# EAGLE board dat1 (EAGLE 6.1)
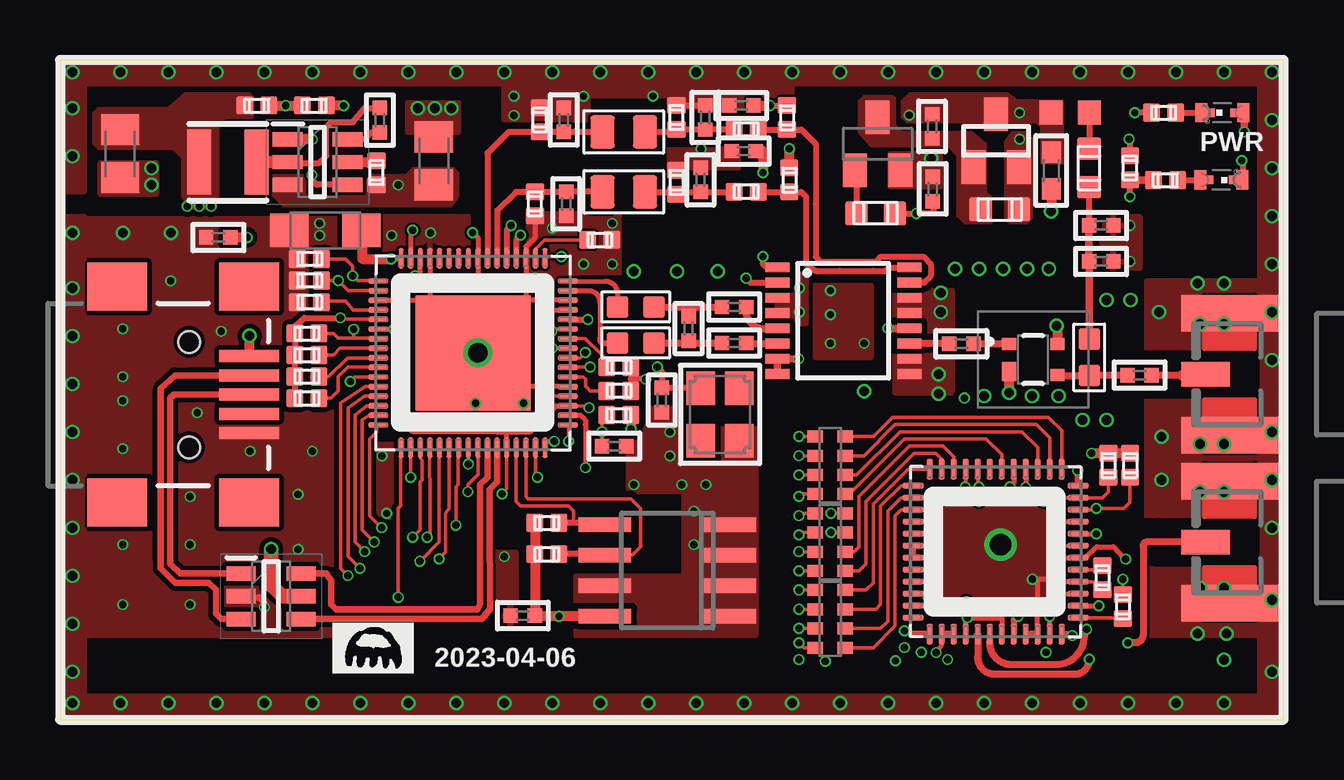
[diagram p2: board, top side]
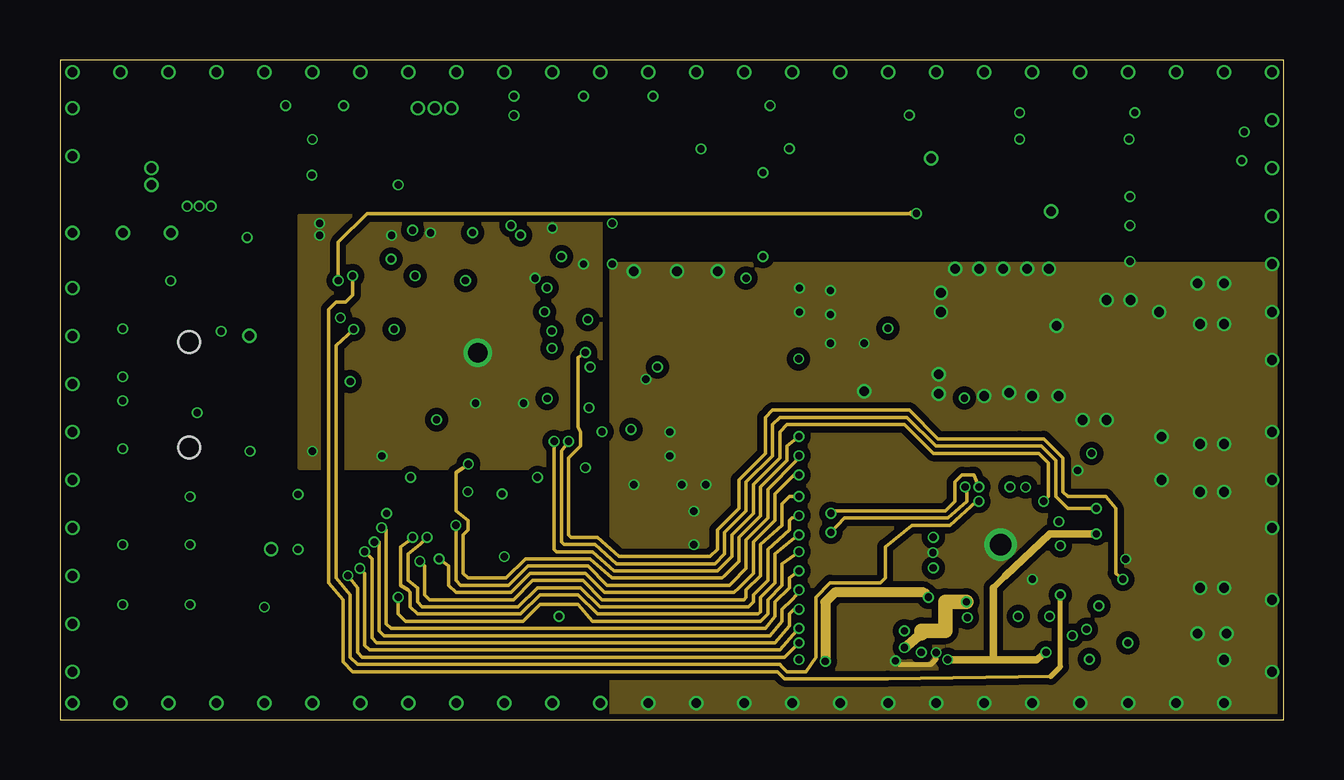
[diagram p3: board, inner layer Route2]
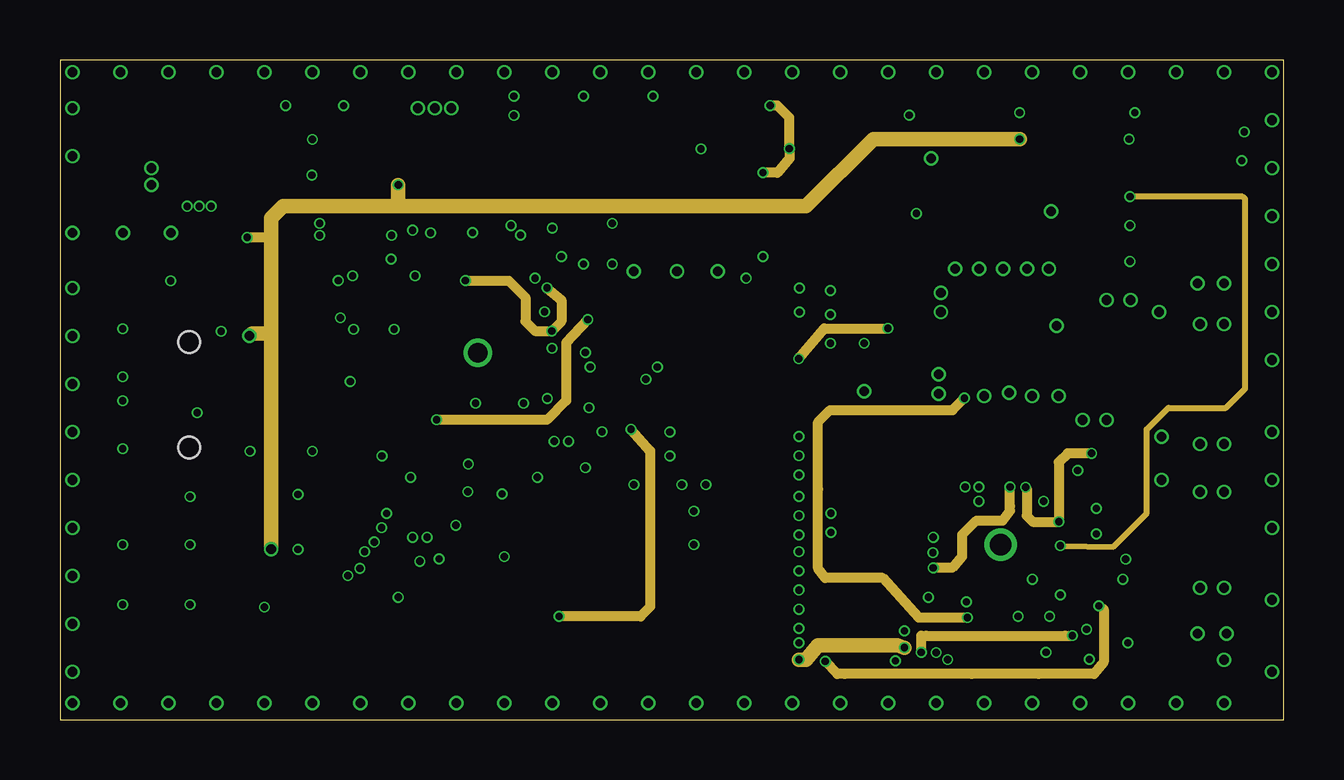
[diagram p4: board, inner layer Route15]
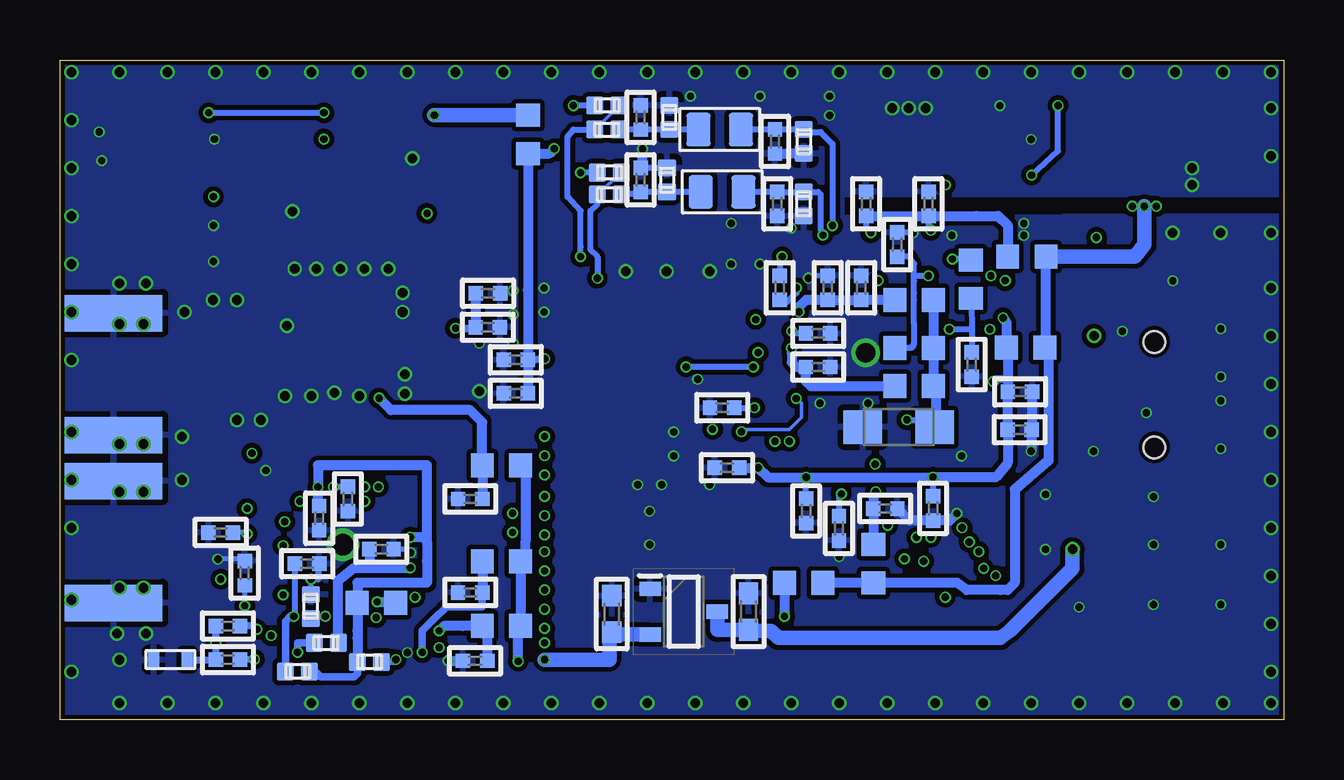
[diagram p5: board, bottom side, seen from below]

Size 51 x 27.5 mm. Coordinates in mm from the lower left corner, seen from the top.
Outline: 0,0 51,0 51,27.5 0,27.5 0,0
Copper layers ((1*2)+(15*16)): Top 0.035mm / dielectric 0.213359375mm / Route2 0.035mm / dielectric 1.0161mm / Route15 0.035mm / dielectric 0.213359375mm / Bottom 0.035mm
Design rules: minimum track width 4mil, minimum drill 0.3mm, track to track 4mil, track to pad 4mil, pad to pad 4mil, via to via 4mil, smd to smd 0mil, copper to edge 4mil, drill to drill 4mil, minimum pad ring 3mil, minimum via ring 3mil, stop-mask expansion 4mil, vias tented up to drill 25mil, thermal gap 10mil
Net classes: 1 USB: width 0.406 mm; 2 gnd: width 0.254 mm, drill 0.584 mm, clearance 0.203 mm
tRestrict: 20 lines

## Footprints (pad centres in the part's own frame; a part is rotated, then mirrored left to right if it is on the bottom)
_0402 = smd 0.6 x 0.6: 1 -0.508,0; 2 0.508,0
C0805K = smd 1.3 x 1.6: 1 -1,0; 2 1,0
SMC_A = smd 1.6 x 1.4: + -1.5,0; - 1.5,0
_0603 = smd 0.9 x 0.8: 1 -0.762,0; 2 0.762,0
INDC1608X95N = smd 0.95 x 1: 1 -0.8,0; 2 0.8,0
SOT95P280X110-6N = smd 1.25 x 0.6: 1 -1.25,0.95; 2 -1.25,0; 3 -1.25,-0.95; 4 1.25,-0.95; 5 1.25,0; 6 1.25,0.95
SOT95P280X145-6N = smd 1.2 x 0.6: 1 -1.25,0.95; 2 -1.25,0; 3 -1.25,-0.95; 4 1.25,-0.95; 5 1.25,0; 6 1.25,0.95
CRYSTALVIDEO_QFN64P40_IT9518 = smd 0.22 x 0.84: 1 -3,-3.945; 2 -2.6,-3.945; 3 -2.2,-3.945; 4 -1.8,-3.945; 5 -1.4,-3.945; 6 -1,-3.945; 7 -0.6,-3.945; 8 -0.2,-3.945; 9 0.2,-3.945; 10 0.6,-3.945; 11 1,-3.945; 12 1.4,-3.945; 13 1.8,-3.945; 14 2.2,-3.945; 15 2.6,-3.945; 16 3,-3.945; 33 3,3.945; 34 2.6,3.945; 35 2.2,3.945; 36 1.8,3.945; 37 1.4,3.945; 38 1,3.945; 39 0.6,3.945; 40 0.2,3.945; 41 -0.2,3.945; 42 -0.6,3.945; 43 -1,3.945; 44 -1.4,3.945; 45 -1.8,3.945; 46 -2.2,3.945; 47 -2.6,3.945; 48 -3,3.945 | smd 0.84 x 0.22: 17 3.945,-3; 18 3.945,-2.6; 19 3.945,-2.2; 20 3.945,-1.8; 21 3.945,-1.4; 22 3.945,-1; 23 3.945,-0.6; 24 3.945,-0.2; 25 3.945,0.2; 26 3.945,0.6; 27 3.945,1; 28 3.945,1.4; 29 3.945,1.8; 30 3.945,2.2; 31 3.945,2.6; 32 3.945,3; 49 -3.945,3; 50 -3.945,2.6; 51 -3.945,2.2; 52 -3.945,1.8; 53 -3.945,1.4; 54 -3.945,1; 55 -3.945,0.6; 56 -3.945,0.2; 57 -3.945,-0.2; 58 -3.945,-0.6; 59 -3.945,-1; 60 -3.945,-1.4; 61 -3.945,-1.8; 62 -3.945,-2.2; 63 -3.945,-2.6; 64 -3.945,-3 | smd 4.776 x 4.776: EP 0,0
SO-08 = smd 0.6 x 2.2: 1 -1.905,-2.6; 2 -0.635,-2.6; 3 0.635,-2.6; 4 1.905,-2.6; 5 1.905,2.6; 6 0.635,2.6; 7 -0.635,2.6; 8 -1.905,2.6
BGA616 = smd 0.5 x 0.58: 1 -0.65,-1.01; 3 0.65,1.01; 4 -0.65,1.01 | smd 0.8 x 0.58: 2 0.5,-1.01
QSOP16 = smd 0.4 x 1: 1 -2.223,-2.75; 2 -1.588,-2.75; 3 -0.953,-2.75; 4 -0.318,-2.75; 5 0.318,-2.75; 6 0.953,-2.75; 7 1.588,-2.75; 8 2.223,-2.75; 9 2.223,2.75; 10 1.588,2.75; 11 0.953,2.75; 12 0.318,2.75; 13 -0.318,2.75; 14 -0.953,2.75; 15 -1.588,2.75; 16 -2.223,2.75
CRYSTALVIDEO_QFN48P50_IT9133 = smd 0.26 x 0.86: 1 -2.75,-3.435; 2 -2.25,-3.435; 3 -1.75,-3.435; 4 -1.25,-3.435; 5 -0.75,-3.435; 6 -0.25,-3.435; 7 0.25,-3.435; 8 0.75,-3.435; 9 1.25,-3.435; 10 1.75,-3.435; 11 2.25,-3.435; 12 2.75,-3.435; 25 2.75,3.435; 26 2.25,3.435; 27 1.75,3.435; 28 1.25,3.435; 29 0.75,3.435; 30 0.25,3.435; 31 -0.25,3.435; 32 -0.75,3.435; 33 -1.25,3.435; 34 -1.75,3.435; 35 -2.25,3.435; 36 -2.75,3.435 | smd 0.86 x 0.26: 13 3.435,-2.75; 14 3.435,-2.25; 15 3.435,-1.75; 16 3.435,-1.25; 17 3.435,-0.75; 18 3.435,-0.25; 19 3.435,0.25; 20 3.435,0.75; 21 3.435,1.25; 22 3.435,1.75; 23 3.435,2.25; 24 3.435,2.75; 37 -3.435,2.75; 38 -3.435,2.25; 39 -3.435,1.75; 40 -3.435,1.25; 41 -3.435,0.75; 42 -3.435,0.25; 43 -3.435,-0.25; 44 -3.435,-0.75; 45 -3.435,-1.25; 46 -3.435,-1.75; 47 -3.435,-2.25; 48 -3.435,-2.75
SOT95P280X130-3N = smd 0.9 x 0.6: 1 -1.4,0.95; 2 -1.4,-0.95; 3 1.4,0
L_3X3 = smd 1 x 2.7: 1 -1.2,0; 2 1.2,0
L0603@1 = smd 0.889 x 0.889: 1 -0.762,0; 2 0.762,0
L0805@1 = smd 1.016 x 1.397: 1 -0.889,0; 2 0.889,0
L0603S = smd 0.508 x 0.762: 1 -0.699,0; 2 0.699,0
CHIPLED-0603-TTW = smd 0.8 x 0.5: A 0,-0.875; C 0,0.875 | smd 0.35 x 0.35: A@1 0,-0.5; C@1 0,0.5
SOT23-BEC = smd 1 x 1.4: B -0.95,-1.1; C 0,1.1; E 0.95,-1.1
SUPER-SOT3 = smd 1 x 1.4: 1 -0.95,-1.1; 2 0.95,-1.1; 3 0,1.1
C0402 = smd 0.75 x 0.7: 1 0,0.5; 2 0,-0.5
C0603 = smd 1 x 0.95: 1 0,0.8; 2 0,-0.8
0603-ARV = smd 0.5 x 0.65: 1 -1.2,-0.625; 2 -0.4,-0.625; 3 0.4,-0.625; 4 1.2,-0.625; 5 1.2,0.625; 6 0.4,0.625; 7 -0.4,0.625; 8 -1.2,0.625
USB-MINIB = smd 2.5 x 0.5: D+ 2.5,0; D- 2.5,0.8; GND 2.5,-1.6; ID 2.5,-0.8; VBUS 2.5,1.6 | smd 2.5 x 2: MTN1 -3,4.5; MTN2 2.5,4.5; MTN3 -3,-4.5; MTN4 2.5,-4.5 | hole 0.9: 0,2.2; 0,-2.2
MODULATOR_MICROBUILDER_SMA_EDGELAUNCH_UFL = smd 4.064 x 1.524: GND@1 2.032,-2.54; GND@2 2.032,2.54 | smd 4.064 x 1.524 bottom: GND@3 2.032,2.54; GND@4 2.032,-2.54 | smd 2.032 x 1.016: P 3.048,0
CRYSTAL_3.2X2.5 = smd 1.4 x 1.2: 1 -1.1,-0.8; 2 1.1,0.8; GND1 -1.1,0.8; GND2 1.1,-0.8

## Placement (x,y rotation side)
C1  100n  [_0402]  13.33,24.99 90 top
C2  100n  [_0402]  6.6,20.1 0 top
C3  10uF  [C0805K]  15.59,23.29 90 top
C4  10uF  [C0805K]  2.51,23.59 270 top
C5  10uf  [SMC_A]  11.06,20.39 180 top
C6  100n  [_0402]  19.29,4.33 180 top
C7  100n  [_0402]  16.6,8.8 0 bottom
C8  100  [_0402]  43.4,19.1 180 top
C9  100n  [_0402]  43.4,20.6 180 top
C10  47  [_0402]  21,18 90 bottom
C11  68  [_0402]  37.57,15.67 0 top
C12  68  [_0402]  45,14.36 0 top
C13  10  [_0402]  26.2,16.3 90 top
C14  1n  [_0402]  28.1,17.2 180 top
C15  1n  [_0402]  28.1,15.7 180 top
C16  10uf  [SMC_A]  16.04,12.19 180 bottom
C17  100n  [_0402]  17.4,21.5 270 bottom
C18  100n  [_0402]  14.8,21.5 270 bottom
C19  100n  [_0402]  19.4,16.1 180 bottom
C20  10n  [_0402]  33.16,17.77 0 bottom
C21  1n  [_0402]  33.17,16.36 0 bottom
C22  10n  [_0402]  32,13.6 180 bottom
C23  1n  [_0402]  32,15 180 bottom
C24  1uF  [_0402]  23.1,11.4 0 top
C25  5.6  [_0402]  25.09,13.32 90 top
C26  100n  [_0402]  13,14.8 90 bottom
C27  100n  [_0402]  18.53,7.97 90 bottom
C28  100n  [_0402]  23.4,13 0 bottom
C29  100n  [_0402]  28.5,23.7 0 top
C30  100n  [_0402]  36.38,22.12 90 top
C31  100n  [_0402]  19,18 270 bottom
C32  100n  [_0402]  17.6,18 270 bottom
C33  68  [_0402]  21.2,24.1 270 bottom
C34  68  [_0402]  26.8,25.1 90 bottom
C35  68  [_0402]  21,25 90 top
C36  68  [_0402]  26.9,25.1 90 top
C37  100n  [_0402]  19.4,14.7 180 bottom
C38  100  [_0402]  36.35,24.73 270 top
C39  68  [_0402]  21.1,21.5 90 bottom
C40  68  [_0402]  26.8,22.5 270 bottom
C41  68  [_0402]  21.1,21.5 90 top
C42  68  [_0402]  26.7,22.5 270 top
C43  100n  [_0402]  11,12.09 180 bottom
C44  100n  [_0402]  19.9,8.7 90 bottom
C45  100n  [_0402]  10.98,13.67 180 bottom
C46  100n  [_0402]  23.2,10.5 0 bottom
C47  100n  [_0402]  14.61,8.8 90 bottom
C48  100n  [_0402]  16.1,19.8 90 bottom
C49  100n  [_0402]  28.4,25.6 0 top
C50  1uF  [_0603]  41.32,22.89 270 top
C51  100n  [_0402]  44.3,7.8 180 bottom
C52  100n  [_0402]  40.2,8.4 270 bottom
C53  100n  [_0402]  33.7,2.45 0 bottom
C54  1uF  [_0402]  43.3,6.1 90 bottom
C55  100n  [_0402]  33.9,9.2 0 bottom
C56  33  [_0402]  44,2.5 180 bottom
C57  100n  [_0402]  33.9,5.3 0 bottom
C58  8.2  [_0402]  44,3.9 180 bottom
C59  1uF  [_0603]  22.3,4.5 90 bottom
C60  1uF  [_0603]  28,4.4 90 bottom
C61  100n  [_0402]  37.6,7.1 0 bottom
C62  100n  [_0402]  39,9.2 270 bottom
C63  100n  [_0402]  40.7,6.5 0 bottom
FB1  FB0603  [INDC1608X95N]  13.03,18.36 90 bottom
FB2  FB0603  [INDC1608X95N]  10.7,19.3 0 bottom
FB3  FB0603  [INDC1608X95N]  20,5.7 0 bottom
FB4  FB0603  [INDC1608X95N]  10.75,15.51 0 bottom
FB5  FB0603  [INDC1608X95N]  17.1,6.5 270 bottom
FB6  FB0603  [INDC1608X95N]  15.4,17.5 0 bottom
FB7  FB0603  [INDC1608X95N]  15.4,13.9 0 bottom
FB8  FB0603  [INDC1608X95N]  31.5,24.4 90 bottom
FB9  FB0603  [INDC1608X95N]  42.1,25.3 180 top
FB10  FB0603  [INDC1608X95N]  15.4,15.5 0 bottom
FB11  FB0603  [INDC1608X95N]  37.81,4.87 180 bottom
FB12  FB0603  [INDC1608X95N]  32.6,3.9 0 bottom
FB13  FB0603  [INDC1608X95N]  32.6,10.6 0 bottom
FB14  FB0603  [INDC1608X95N]  32.6,6.6 0 bottom
IC1  TPS562200DDCR  [SOT95P280X110-6N]  10.74,23.24 0 top
IC2  USBLC6-2SC6  [SOT95P280X145-6N]  8.8,5.14 0 top
IC3  CRYSTALVIDEO_IT9518  [CRYSTALVIDEO_QFN64P40_IT9518]  17.22,15.28 180 top
IC4  24C02  [SO-08]  25.31,6.22 90 top
IC5  BGA616  [BGA616]  40.56,15.01 270 top
IC6  AD8346  [QSOP16]  32.65,16.63 270 top
IC7  CRYSTALVIDEO_IT9133  [CRYSTALVIDEO_QFN48P50_IT9133]  39,7 0 top
IC8  XC6206P332MR  [SOT95P280X130-3N]  25,4.5 0 bottom
L1  4.7uH  [L_3X3]  7,23.24 0 top
L2  100nH  [L0603@1]  42.9,15.1 90 top
L3  4.7nH  [L0603@1]  24,17.2 0 top
L4  4.7nH  [L0603@1]  24,15.7 0 top
L5  10uF  [L0805@1]  23.5,24.6 180 bottom
L6  10uF  [L0805@1]  23.5,24.5 0 top
L7  10uF  [L0805@1]  23.4,22 180 bottom
L8  10uF  [L0805@1]  23.5,22 0 top
L9  100nH  [L0603S]  46.4,2.5 0 bottom
LED1  POWER  [CHIPLED-0603-TTW]  48.45,25.3 90 top
LED2  POWER  [CHIPLED-0603-TTW]  48.4,22.5 270 top
Q1  MMBT3904  [SOT23-BEC]  34.08,24 0 top
Q2  FDN360P  [SUPER-SOT3]  39.02,24.13 0 top
R1  10k  [C0402]  10.3,16.1 90 top
R2  10k  [C0402]  10.3,15.2 90 top
R3  10k  [C0402]  10.3,14.3 90 top
R4  10k  [C0402]  10.3,13.4 90 top
R5  10k  [C0402]  10.4,17.4 270 top
R6  10k  [C0402]  10.4,18.3 270 top
R7  10k  [C0402]  13.2,22.8 180 top
R8  10k  [C0402]  10.4,19.2 270 top
R9  33k  [C0402]  8.2,25.6 90 top
R10  10k  [C0402]  10.6,25.6 90 top
R11  10  [C0603]  42.9,23 180 top
R12  4.7k  [C0402]  20.3,6.9 90 top
R13  4.7k  [C0402]  20.3,8.2 90 top
R14  5.49k  [C0402]  22.5,20 90 top
R15  10k  [C0402]  23.3,12.7 90 top
R16  10k  [C0402]  23.3,13.7 270 top
R17  30.1k  [C0402]  23.3,14.7 270 top
R18  1k  [C0402]  46,25.3 90 top
R19  6.98k  [C0402]  30.3,25.1 0 top
R20  6.98k  [C0402]  30.4,22.5 0 top
R21  300  [C0402]  20,25 180 top
R22  300  [C0402]  25.7,25.1 180 top
R23  100k  [C0603]  34,21.11 270 top
R24  300  [C0402]  20,24.1 0 bottom
R25  300  [C0402]  25.6,25.1 180 bottom
R26  499  [C0402]  28.2,24.6 90 bottom
R27  499  [C0402]  28.6,24.6 270 top
R28  499  [C0402]  28.1,21.9 90 bottom
R29  499  [C0402]  28.6,22 270 top
R30  300  [C0402]  20,21.5 180 bottom
R31  300  [C0402]  25.7,22.5 0 bottom
R32  6.98k  [C0402]  28.1,22.8 270 bottom
R33  6.98k  [C0402]  28.2,25.6 270 bottom
R34  300  [C0402]  19.8,21.5 180 top
R35  300  [C0402]  25.7,22.4 0 top
R36  100k  [C0603]  39.17,21.27 90 top
R37  0  [C0402]  39.9,3.2 90 bottom
R38  10k  [C0402]  38.1,2.4 270 bottom
R39  10k  [0603-ARV]  32.1,4.2 90 top
R40  10k  [0603-ARV]  32.1,7.4 90 top
R41  10k  [0603-ARV]  32.1,10.6 90 top
R42  4.7k  [C0402]  40.54,4.71 180 bottom
R43  68  [C0402]  41.1,2 270 bottom
R44  4.7k  [C0402]  44.6,10.6 0 top
R45  0  [C0402]  44.3,4.7 0 top
R46  4.7k  [C0402]  43.7,10.6 0 top
R47  1k  [C0402]  46.08,22.49 90 top
R48  5.1k  [C0402]  44.6,23 180 top
R49  10k  [C0402]  43.45,5.92 0 top
USB  USBSMD  [USB-MINIB]  5.39,13.55 0 top
X1  [MODULATOR_MICROBUILDER_SMA_EDGELAUNCH_UFL]  50.8,14.4 180 top
X2  [MODULATOR_MICROBUILDER_SMA_EDGELAUNCH_UFL]  50.8,7.4 180 top
Y1  12MHz  [CRYSTAL_3.2X2.5]  27.51,12.72 270 top

## Tracks (layer width: path | path; a pad name or v marks a point on that pad's centre or on a via)
1V2_2  (via drill 0.3)
  Top 0.2: IC7.29 39.75,9.85 v39.6,9.7 | v36.4,6.32 36.35,6.25 IC7.44
  Route15 0.406: v36.4,6.32 36.89,6.33 37.19,6.33 37.6,6.8 37.6,7.7 38.2,8.3 38.7,8.3 39.3,8.3 39.6,8.7 39.6,8.9 v39.6,9.7
  Bottom 0.2: R37.2 39.4,3.5
  Bottom 0.254: C62.1 v39.6,9.71 v39.6,9.7
  Bottom 0.406: 39.4,3.5 39.4,5.8 38.77,6.32 38.1,6.32 | 38.1,6.32 v36.4,6.32 | C61.1 38.1,7.01 38.1,6.32
3.3V  (via drill 0.3)
  Route2 0.406: v35.2,3 35.9,3.6
  Route2 0.61: 35.9,3.6 35.9,3.7 36.9,3.7 36.9,4.91 37.69,4.9 v37.78,4.91
  Route15 0.61: v30.8,2.5 31.1,2.5 31.6,3.1 34.91,3.1 v35.2,3
  Bottom 0.406: C60.1 28,3.55 28.05,3.6 | v37.78,4.91 37.05,4.9 37.05,4.87 FB11.1
  Bottom 0.61: IC8.2 28,3.55 | C60.1 28,3.6 | 28.05,3.6 28.1,3.6 28.1,2.5 v30.8,2.5
+3V3  (via drill 0.3)
  Bottom 0.406: FB2.2 9.9,15.56 FB4.2 9.8,15.36 9.8,10.8 11.2,9.6 11.2,5.7 11.5,5.4 11.8,5.4 13.2,5.4 13.6,5.7 14,5.7 15.6,5.7 15.9,5.7 16.7,5.7 FB5.2 FB3.2
  Bottom 0.61: v5.8,21.4 5.8,19.8 6.2,19.3 FB2.2
  other vias: 6.3,21.4 5.3,21.4
  pour Top (isolate 0.254, no thermals): 8,25.1 6.9,25.1 6.6,24.9 6.6,21.8 6.2,21.3 5.5,21.3 5.1,21.8 5.1,23.4 4.7,23.8 1.6,23.8 1.4,24 1.4,25.3 1.6,25.5 4.5,25.5 5.2,26.1 7.9,26.1 8.1,25.9 8.1,25.3
AVDD  (via drill 0.3)
  Top 0.152: IC3.57 21.14,15.49 v20.51,15.48
  Bottom 0.152: C37.2 20,14.7 20,14.8 19.9,14.79
  Bottom 0.254: 19.9,14.1 19.91,14.11
  Bottom 0.406: 19.9,14.1 19.7,13.9 FB7.1 | v20.51,15.48 20.5,14.9 20.3,14.7 C37.2 19.91,14.11
AVDD1_2  (via drill 0.3)
  Top 0.2: IC7.1 arc45 36.17,3.6 35.56,3.6 35.3,3.6 v35.2,3.7
  Bottom 0.2: FB12.1 arc45 33.19,3.88
  Bottom 0.406: 33.19,3.88 C53.2 | FB12.1 33.6,3.7 33.8,3.9 34.2,3.9 35,3.9 v35.2,3.7
AVDD2_2  (via drill 0.3)
  Top 0.2: IC7.7 39.25,4.25 v37.82,4.25 37.75,4.18 37.75,3.88 IC7.4
  Route15 0.406: v37.82,4.25 37.55,4.25 36.9,4.25 35.8,4.25 34.3,5.9 31.9,5.9 31.6,6.3 31.6,9.6 31.6,12.4 32.1,12.9 37.2,12.9 v37.7,13.4
  Bottom 0.406: C55.2 FB13.1 33.4,12.4 33.9,12.9 37.2,12.9 v37.7,13.4
AVDD3_2  (via drill 0.3)
  Top 0.2: v42.2,3.5 42.06,3.56 IC7.12
  Route15 0.406: v35.9,2.8 35.9,3.3 35.9,3.5 36.1,3.5 41.9,3.5 v42.2,3.5
  Bottom 0.2: C57.2 | 33.4,4.7 33.5,4.7 | 34.9,4.7 35,4.6
  Bottom 0.305: C57.2 33.4,4.7 | 33.5,4.7 34.9,4.7 | 35,4.6 35.3,4.3 35.9,3.7 v35.9,2.8
  Bottom 0.406: FB14.1 C57.2
AVDD3V3  (via drill 0.3)
  Top 0.152: v20.5,16.2 20.58,16.28 IC3.59
  Top 0.2: v14.7,20.4 14.62,20.28 IC3.15 | v17.2,20.3 17.42,20.09 IC3.8 17.42,19.2 17.42,18.5 17.2,18.3 v16.9,18.3
  Route15 0.406: v16.9,18.3 18.7,18.3 19.4,17.6 19.4,16.6 19.8,16.2 v20.5,16.2 20.9,16.6 20.9,17.5 v20.3,18
  Bottom 0.152: C18.2 14.59,21 | 20.3,16.1 20.4,16.1 | C10.1 20.91,17.4
  Bottom 0.254: C19.2 20.3,16.1 | 20.4,16.1 v20.5,16.2 | C18.2 14.8,20.6 v14.7,20.4 | C17.2 17.4,20.5 v17.2,20.3 | 20.91,17.4 20.7,17.4 20.3,17.8 v20.3,18
  Bottom 0.406: C17.2 C18.2 | 14.59,21 12.8,21 11.9,21 11.5,20.6 FB2.1
AVDD_MOD  (via drill 0.3)
  Top 0.254: v29.6,25.6 R19.1
  Top 0.305: IC6.7 29.95,15.05 | 29.95,15.05 30.6,15.04 | 30.6,15.04 v30.79,15.04 30.6,15.04 | v34.51,16.31 IC6.12 | 29.95,15.05 29.9,14.96 IC6.8
  Top 0.406: v34.51,16.31 v34.51,16.3 | R20.1 v30.4,23.8 | C29.2 29.3,23.7 v29.3,22.8 | C49.2 v29.6,25.6
  Route15 0.406: v29.3,22.8 29.9,22.79 30.41,23.4 v30.4,23.8 30.4,25.1 29.9,25.6 v29.6,25.6 | v30.79,15.04 31.86,16.31 v34.51,16.31
  Bottom 0.254: R33.2 v29.6,25.6 | R32.2 28.9,22.8 | 28.9,22.8 v29.3,22.8 28.9,22.8
  Bottom 0.305: C21.1 34.03,16.31 v34.51,16.31 | C23.1 v30.79,15.04
  Bottom 0.406: C22.1 C23.1 31.49,17.89 FB8.1 30.6,23.6 v30.4,23.8 | C20.1 C21.1
AVDD_PA
  Top 0.254: FB9.1 42.9,25.2 R11.2
AVDDHP  (via drill 0.3)
  Top 0.152: IC3.41 17.43,10.21 17,9.8 v17,9.5
  Bottom 0.406: v17,9.5 v17.01,9.49 17.1,9.3 C7.1 17.1,8.69 FB5.1
CK0  (via drill 0.3)
  Top 0.152: IC3.56 21.67,15.08 v21.9,15.3 | v44.3,5.85 R45.1
  Route2 0.152: v21.9,15.3 21.6,15.1 21.6,12.2 21.7,12 21.7,11.4 21.2,10.9 21.2,9.8 21.2,7.9 21.2,7.7 21.3,7.6 22.4,7.6 23.3,6.8 24.6,6.8 27.1,6.8 27.4,7.1 27.4,7.9 28.3,8.8 28.3,9 28.3,9.6 28.3,10 29.4,11.1 29.4,12.6 29.7,12.9 32.4,12.9 35.4,12.9 36.6,11.7 40,11.7 41,11.7 41.8,10.9 41.8,9.5 42,9.3 43.6,9.3 44,8.8 44,6.1 v44.3,5.85
GND  (via drill 0.3, 0.4, 0.8, 0.9)
  Top 0.152: IC3.19 13.29,17.48 | IC3.EP 16.72,15.28 14.89,17.48 14.9,17.2 15.42,17.49 | IC3.13 15.42,19.2 | IC3.3 19.42,19.2 | 19.42,17.49 18.45,15.85 17.22,15.82 IC3.EP | IC3.62 21.14,17.48 | IC3.53 21.14,13.88 | 19.3,13.88 18.32,15.28 IC3.EP | v19.8,18.4 19.43,18.4 | R49.2 43.06,5.75 IC7.16
  Top 0.2: 13.29,17.48 14.49,17.48 14.89,17.48 | 15.42,19.2 15.42,17.49 | 19.42,19.2 19.43,18.4 19.42,17.49 21.14,17.48 | 21.14,13.88 19.3,13.88 | 19.8,20.1 R34.1 19.8,20.1 | 19.8,20.1 19.42,19.72 IC3.3 | v36.52,2.79 36.75,3.12 IC7.2 | IC7.16 41.81,5.75 41.8,5.85 | 41.8,5.85 41.8,6.75 IC7.18 42.48,6.75 42.52,6.74 42.72,6.74 43.2,7.2 43.9,7.2 44.33,6.75 44.39,6.72 v44.42,6.69 | IC7.10 40.74,3.62 40.74,4.7 40.74,4.9 | IC7.43 35.6,6.75 35.55,6.77 | IC7.43 35.58,6.74 36.01,6.74 36.23,6.96 v36.38,6.96 | IC7.42 IC7.43 | 40.74,5.85 41.55,5.85 41.56,5.85 41.8,5.85 | 40.74,5.85 40.74,4.9 | v40.53,5.85 40.74,5.85 | 40.74,5.85 40.74,4.9
  Top 0.254: LED1.A@1 | C36.2 R22.2 | IC2.2 7.59,5.1 8.3,5.1 8.52,4.88 v8.52,4.69 | R8.2 9.9,19.8 9.56,20.04 C5.- | v49.26,23.3 49.3,23.36 49.3,22.6 49.2,22.5 LED2.C@1 | v44.56,24.2 44.6,24.24 R48.2 | IC7.24 42.42,9.75 v42.42,10.39 | R17.1 23.8,14.2 | 23.8,14.2 23.8,13.9 | 23.8,13.9 R16.1 | 24.03,13.6 R16.1 | v24.42,14.19 v24.41,14.2 23.8,14.2 | 23.8,14.2 23.8,13.9 | 23.8,13.9 R16.1 | IC7.10 IC7.9 | IC7.3 IC7.2
  Top 0.305: v49.36,24.5 49.36,25.3 LED1.A@1
  Top 0.406: IC5.2 v39.56,13.62 | C50.2 v41.32,21.19 | v10.52,24.19 IC1.1 | C4.2 2.81,22.29 | v11.82,25.59 11.71,25.6 R10.2 | v41.54,16.41 41.57,16.31 IC5.4 | Q1.E 35.22,22.9 | C30.2 36.32,22.63
  Route2 0.2: v34.82,2.45 35.01,2.3 36.3,2.3 36.52,2.52 v36.52,2.79
  Bottom 0.2: C31.1 19.41,18.5 19.7,18.5 v19.8,18.4 | C54.2 43.38,6.69 v44.42,6.69 | v36.38,6.96 36.52,7.1 C61.2 | 40.69,5.39 40.53,5.39 v40.53,5.85
  Bottom 0.254: R31.1 C40.1 | v15.45,20.29 15.47,20.31 C48.2 | R42.2 40.69,5.39 | C63.2 40.24,6.5 40.24,5.84 | 40.24,5.84 v40.53,5.85 40.24,5.84
  Bottom 0.406: R24.2 20.62,23.6 20.62,23.59 C33.2 | C45.1 10.49,13.67 C43.1 10.52,12.09 v10.52,11.19 | C40.1 26.72,23.01 v26.72,23.79 | C7.2 15.59,8.3 C47.1 13.92,8.29 v13.62,8.59 | v34.82,2.45 C53.1
  other vias: 44.6,19.1 44.6,20.6 36.72,16.99 24.72,25.99 36.32,23.39 5.72,12.79 13.42,10.99 17.42,15.29 23.92,9.79 7.92,11.19 16.32,25.49 18.92,25.19 10.82,20.69 13.82,20.19 14.92,25.49 25.42,11.99 9.92,7.09 2.62,7.29 2.62,11.29 2.62,14.29 4.62,18.29 30.82,16.99 9.92,9.39 23.02,18.99 5.42,7.29 6.72,16.19 21.82,18.99 36.62,14.39 4.62,20.29 2.62,13.29 2.62,16.29 18.52,6.79 19.32,13.19 17.32,13.19 39.2,7.3 48.52,2.49 48.62,3.59 47.52,11.49 47.52,9.49 2.62,20.29 3.82,22.99 3.82,22.29 15.62,25.49 25.92,9.79 26.92,9.79 25.42,10.99 26.42,7.29 2.62,4.79 5.42,4.79 5.42,9.29 20.52,20.49 18.92,25.99 21.82,25.99 30.82,17.99 37.32,18.79 41.22,18.79 45.92,11.79 38.52,13.49 27.42,18.69 23.92,18.69 25.72,18.69 38.32,18.79 39.32,18.79 40.32,18.79 45.92,9.99 45.82,16.99 48.52,5.49 48.52,11.49 48.52,9.49 47.42,3.59 47.52,5.49 47.52,16.49 48.52,16.49 48.52,18.19 47.42,18.19 40.52,13.49 41.62,13.49 26.42,8.69 36.72,17.79 36.62,13.59 33.52,15.69 43.62,12.49 42.62,12.49 43.62,17.49 44.62,17.49 0.52,26.99 2.52,26.99 4.52,26.99 6.52,26.99 8.52,26.99 10.52,26.99 12.52,26.99 14.52,26.99 16.52,26.99 18.52,26.99 20.52,26.99 22.52,26.99 24.52,26.99 26.52,26.99 28.52,26.99 30.52,26.99 32.52,26.99 34.52,26.99 36.52,26.99 38.52,26.99 40.52,26.99 42.52,26.99 44.52,26.99 46.52,26.99 48.52,26.99 0.52,20.29 0.52,17.99 0.52,15.99 0.52,13.99 0.52,11.99 0.52,9.99 0.52,7.99 0.52,5.99 0.52,3.99 0.52,1.99 50.52,26.99 50.52,24.99 50.52,22.99 50.52,20.99 50.52,18.99 50.52,16.99 50.52,14.99 50.52,11.99 50.52,9.99 50.52,7.99 50.52,4.99 50.52,1.99 0.52,0.69 2.52,0.69 4.52,0.69 6.52,0.69 8.52,0.69 10.52,0.69 12.52,0.69 14.52,0.69 16.52,0.69 18.52,0.69 20.52,0.69 22.52,0.69 24.52,0.69 26.52,0.69 28.52,0.69 30.52,0.69 32.52,0.69 34.52,0.69 36.52,0.69 38.52,0.69 40.52,0.69 42.52,0.69 44.52,0.69 46.52,0.69 48.52,0.69 0.52,25.49 0.52,23.49 10.82,20.19 33.52,13.69 32.12,15.69 32.12,17.89 32.12,16.89 23.02,20.69
  pour Bottom (isolate 0.2, rank 3): 51,0 0,0 0,21 18.4,20.9 18.4,21.9 0,21.9 0,27.5 51,27.5
  pour Top: 41.2,5.2 36.8,5.2 36.9,8.8 41.3,8.8
  pour Top (no thermals): 4,21.9 1.7,21.9 1.7,23.2 4,23.2
  pour Top (no thermals): 16.6,24.5 14.5,24.5 14.5,25.7 16.6,25.7
  pour Top (isolate 0.2, no thermals): 0,20.9 11.5,20.9 11.5,11.5 21.5,11.5 21.5,8 11.5,8 11.5,3.5 0,3.5
  pour Top (isolate 0.254, no thermals): 23,13 29,13 29,3.5 21.5,3.5 21.5,6 26,6 26,9.5 23,9.5
  pour Top: 19,4 18,4 18,7 19,7
  pour Top (no thermals): 23.3,18.3 19.6,18.3 19.5,21.1 23.3,21.1
  pour Top: 17,19.5 13.5,19.5 13.5,21 17,21
  pour Route2 (isolate 0.254): 22.5,10.5 10,10.5 10,21 22.5,21
  pour Top (isolate 0.254, no thermals): 37.2,13.6 34.8,13.6 34.8,17.9 37.2,17.9
  pour Top (isolate 0.254, no thermals): 31.1,16.5 29.9,16.5 29.9,18.6 31.1,18.6
  pour Top (isolate 0.254): 45,18.8 43.4,18.8 43.4,21 45,21
  pour Route2 (isolate 0.254): 50.9,0.1 23,0.1 23,19 50.9,19
  pour Top (no thermals): 51,3.5 45.3,3.5 45.3,18.3 51,18.3
  pour Top (isolate 0.1, no thermals): 1,21 1,1 50,1 50,26.5 30.5,26.5 30.5,23 25.4,23 25.4,26 22,26 22,25 18.5,25 18.5,26.5 1,26.5 1,22 0,22 0,27.5 51,27.5 51,0 0,0 0,21
  pour Top (no thermals): 36.7,22.2 34.6,22.2 34.6,23.6 36.7,23.6
  pour Top: 33.8,15.1 31.5,15.1 31.5,18.1 33.8,18.1
  pour Top (no thermals): 23.3,18.3 19.6,18.3 19.5,21.1 23.3,21.1
HOST_B0  (via drill 0.3)
  Top 0.152: IC3.28 12.71,13.88 11.7,13.2 11.7,8.9 11.7,6.3 v12,6 | v30.8,3.2 31,3 R39.8
  Route2 0.152: v12,6 12.4,5.5 12.4,5.2 12.4,3.4 12.4,2.8 12.6,2.6 19.8,2.6 29.2,2.6 30.2,2.6 30.6,3 v30.8,3.2
HOST_B1  (via drill 0.3)
  Top 0.152: IC3.29 13.26,13.5 12.7,13.5 12,13 12,8.9 12,6.8 v12.5,6.3 | v30.8,3.8 R39.7
  Route2 0.152: v12.5,6.3 12.7,6.1 12.7,3.7 12.7,3.1 12.9,2.9 19.7,2.9 29.2,2.9 30,2.9 30.7,3.7 v30.8,3.8
HOST_B2  (via drill 0.3)
  Top 0.152: IC3.30 13.24,13.08 12.79,13.08 12.3,12.7 12.3,9 12.3,8 12.3,7.4 v12.7,7 | v30.8,4.6 30.9,4.6 R39.6
  Route2 0.152: v12.7,7 13,6.7 13,5.9 13,5.4 13,3.9 13,3.4 13.2,3.2 19.6,3.2 29.1,3.2 29.8,3.2 30.4,3.9 30.4,4.4 30.6,4.6 v30.8,4.6
HOST_B3  (via drill 0.3)
  Top 0.152: IC3.31 13.26,12.7 12.9,12.7 12.6,12.5 12.6,10.1 12.6,9 12.6,8.3 | 12.6,8.3 12.6,7.9 | 12.6,7.9 12.6,8.3 | 12.6,8.3 12.6,7.9 | 12.6,7.9 v13.1,7.4 | v30.8,5.4 31,5.4 R39.5
  Route2 0.152: v13.1,7.4 13.3,7.4 13.3,4 13.3,3.7 13.5,3.5 19.6,3.5 29.2,3.5 29.6,3.5 30.1,4.1 30.1,4.6 30.5,5 30.7,5.2 30.8,5.3 v30.8,5.4
HOST_B4  (via drill 0.3)
  Top 0.152: IC3.32 13.2,12.21 13.2,12 12.9,11.7 12.9,8.5 v13.4,8 | v30.8,6.2 R40.8
  Route2 0.152: v13.4,8 13.6,7.9 13.6,4.3 13.6,4 13.8,3.8 14.1,3.8 19.4,3.8 29.1,3.8 29.4,3.8 29.8,4.3 29.8,4.9 30.4,5.5 30.4,5.9 v30.8,6.2
HOST_B5  (via drill 0.3)
  Top 0.152: IC3.33 14.2,11.21 14.2,8.9 14.1,8.8 14.1,7.7 v14.1,5.1 | v30.8,7 30.7,7 v30.8,7 | v30.8,7 R40.7
  Route2 0.152: v14.1,5.1 14.1,4.4 14.2,4.3 14.4,4.1 19.3,4.1 20,4.8 21.6,4.8 22.2,4.1 24.4,4.1 28.9,4.1 29.2,4.1 29.5,4.4 29.5,5 30.1,5.6 30.1,6.5 v30.8,7
HOST_B6  (via drill 0.3)
  Top 0.152: IC3.35 15.02,10.93 15.1,10.8 15.1,10.1 15.1,10 15,9.9 15,7.9 v14.7,7.6 | v30.8,7.7 30.9,7.8 R40.6
  Route2 0.152: v14.7,7.6 14.6,7.5 14.2,7.2 14.2,5.6 14.5,5.4 14.6,5.3 14.6,4.7 14.9,4.4 19.2,4.4 20,5.2 21.6,5.2 22.4,4.4 24.1,4.4 28.4,4.4 29.1,4.4 29.2,4.5 29.2,5.1 29.8,5.7 29.8,6.9 30.5,7.5 v30.8,7.7
HOST_B7  (via drill 0.3)
  Top 0.152: IC3.36 15.42,8.81 15.42,7.71 v15.3,7.6 | v30.8,8.5 30.9,8.6 R40.5
  Route2 0.152: v15.3,7.6 15,7.3 14.5,6.9 14.5,6.8 14.5,5.8 14.9,5.5 14.9,5.1 14.9,4.9 15.1,4.7 19.1,4.7 19.9,5.5 21.7,5.5 22.5,4.7 24.1,4.7 27.9,4.7 28.7,4.7 28.9,4.9 28.9,5.2 29.5,5.8 29.5,7.1 30.4,7.9 30.4,8.3 30.5,8.4 v30.8,8.5
HOST_B8  (via drill 0.3)
  Top 0.152: IC3.37 15.8,11.31 15.8,8.8 15.8,7.4 v15,6.6 | v30.8,9.3 30.9,9.4 R41.8
  Route2 0.152: v15,6.6 15.2,6.4 15.2,5.2 15.4,5 18.9,5 19.7,5.8 21.8,5.8 22.6,5 24.1,5 28.2,5 28.5,5 28.6,5.1 28.6,5.4 29.2,6 29.2,7.3 30.1,8.1 30.1,9 30.4,9.3 v30.8,9.3
HOST_B9  (via drill 0.3)
  Top 0.152: IC3.38 16.22,8.81 16.08,8.6 16.08,7 v15.8,6.7 | v30.8,10.2 R41.7
  Route2 0.152: v15.8,6.7 16.2,6.4 16.2,5.8 16.2,5.6 16.5,5.3 18.8,5.3 19.6,6.1 20.2,6.1 21.9,6.1 22.7,5.3 24.1,5.3 27.8,5.3 28.1,5.3 28.3,5.5 28.9,6.1 28.9,7 28.9,7.4 29.8,8.3 29.8,9.1 29.8,9.4 30.6,10.2 v30.8,10.2
HOST_B10  (via drill 0.3)
  Top 0.152: IC3.39 16.62,11.25 16.6,11.25 16.6,9.81 16.5,9.7 v16.5,8.1 | v30.8,11 R41.6
  Route2 0.152: v16.5,8.1 16.5,7.4 16.5,6.7 16.5,6 16.5,5.8 16.7,5.6 18.7,5.6 19.5,6.4 20.1,6.4 22,6.4 22.8,5.6 23.8,5.6 25,5.6 27.4,5.6 27.9,5.6 28,5.7 28.6,6.3 28.6,7.5 29.5,8.4 29.5,9.4 29.5,9.6 30.7,10.8 30.7,10.9 v30.8,11
HOST_B11  (via drill 0.3)
  Top 0.152: IC3.40 17.02,11.16 v17.02,10.65 | v30.8,11.8 R41.5
  Route2 0.152: v17.02,10.65 16.8,10.5 16.5,10.3 16.5,8.7 17,8.3 17,7.9 16.8,7.7 16.8,6.9 16.8,6.5 16.8,6.1 17,5.9 17.3,5.9 18.6,5.9 19.4,6.7 20.4,6.7 22.1,6.7 23,5.9 25,5.9 27,5.9 27.6,5.9 27.7,6 28.3,6.6 28.3,7.6 29.2,8.5 29.2,9.3 29.2,9.7 30.3,10.8 30.3,11.4 v30.8,11.8
IC2_VCC1_2  (via drill 0.3)
  Top 0.2: IC7.20 42.48,7.74 v43.2,7.74
  Route2 0.254: 38.9,2.5 38.9,3.7 | 38.9,5.5 39.4,6
  Route2 0.305: 38.9,5.5 38.9,4 38.9,3.7 38.9,2.5 | 39.4,6 41.25,7.75 v43.2,7.74 | 38.9,2.5 38.4,2.5 37.4,2.5 v37,2.5 | 38.9,2.5 40.7,2.5 v41.1,2.8
  Bottom 0.2: v43.2,7.74 43.2,7.8 C51.1
  Bottom 0.254: R38.1 37.1,2.4 v37,2.5
  Bottom 0.305: R37.1 41.1,3.2 v41.1,2.8
IN  (via drill 0.3)
  Top 0.254: v28.6,18.4 28.78,18.22 IC6.2
  Bottom 0.152: R32.1 R28.1
  Bottom 0.254: R28.1 28.6,21.5 28.9,21.2 28.9,19.6 28.6,19.3 v28.6,18.4
IP  (via drill 0.3)
  Top 0.254: IC6.1 29.85,18.8 29.5,18.8 29.3,19 v29.3,19.3
  Bottom 0.152: R33.1 R26.1
  Bottom 0.254: v29.3,19.3 29.3,19.7 29.3,21.2 29.85,21.8 29.85,23.1 29.85,23.2 29.85,24.3 29.6,24.6 R26.1
LOCK_LED_S  (via drill 0.3)
  Top 0.152: IC7.19 42.38,7.25 v41.7,7.25
  Top 0.254: v44.6,21.8 44.6,22.1 R48.1
  Top 0.305: R47.1 R48.1
  Route15 0.254: v41.7,7.25 43.9,7.2 45.3,8.6 45.3,11.1 45.3,12.1 46.2,13 48.6,13 49.4,13.8 49.4,16.3 49.4,21.7 49.3,21.8 v44.6,21.8
N$2
  Top 0.254: IC1.2 9.33,23.2 10.8,23.2 11.1,23.5 11.1,24.7 11.3,24.9 12.2,24.9 12.7,25.5 C1.2
  Top 0.5: IC1.2 L1.2
N$3  (via drill 0.3)
  Top 0.152: IC3.55 21.18,14.7 v22.1,14.7 | Y1.1
  Top 0.254: v24.9,14.7 25.09,14.51 C25.2 Y1.1
  Bottom 0.254: v22.1,14.7 v24.9,14.7
N$4
  Top 0.152: IC3.26 13.26,14.7 12,14.7 11.6,14.3 11.6,13.7 11.3,13.4 R4.2
N$5
  Top 0.152: IC3.54 21.18,14.28 21.8,14.28 21.9,14.2 21.9,13.9 22,13.8 22.1,13.7 22.3,13.7 R16.2
N$6  (via drill 0.3)
  Top 0.152: IC3.52 21.18,13.48 IC3.52 | 22.6,12.7 R15.1 22.59,12.99 v22.59,12 C24.1 | IC3.52 21.14,13.5 20.43,13.49 v20.31,13.39
  Bottom 0.152: v20.31,13.39 20.1,13.2 20.1,12.6 20.6,12.1 22.3,12.1 22.4,12.1 v22.59,12
N$7
  Top 0.152: R45.2 43.85,4.25 IC7.13
N$8
  Top 0.277: USB.D- 7.84,14.35 5.4,14.35 4.8,14.35 4.2,13.8 4.2,9.8 4.2,6.6 4.2,6.3 4.8,5.7 6.2,5.7 6.5,5.4 6.5,4.4 6.71,4.19 IC2.3 7.46,4.1
N$9
  Top 0.254: IC1.6 11.8,24.2 12.7,24.2 12.98,24.48 C1.1
N$10  (via drill 0.3)
  Top 0.2: IC3.16 14.2,19.2 v13.8,19.2
  Top 0.406: C5.+ 12.5,20.39 12.6,20.2 12.6,19.2 v13.8,19.2
  Bottom 0.2: 13.14,19.06 FB1.2
  Bottom 0.254: 13.14,19.06 13.3,19.2 v13.8,19.2
N$11
  Top 0.152: 21.18,15.89 IC3.58 21.18,15.89 | 21.18,15.89 21.89,15.89 22.6,15.2 22.8,15 R17.2 22.6,14.6 22.6,14.8
N$12
  Top 0.152: IC3.45 19.02,11.31 19.02,9.1 19.2,8.9 21.2,8.9 21.4,8.7 21.4,8.2
  Top 0.254: IC4.5 22.64,8.2 21.4,8.2 R13.2
N$13
  Top 0.152: IC3.46 19.42,11.43 19.42,9.31 19.5,9.2 21.3,9.2 23.8,9.2 24.2,8.8 24.2,7.2 23.86,6.86 IC4.6
  Top 0.254: IC4.6 22.66,6.9 R12.2
N$14
  Top 0.152: IC3.64 arc-90 21.18,18.27
  Top 0.2: 21.18,18.27 22.7,18.28 arc-90 23.24,17.78 L3.1
N$15
  Top 0.152: IC3.63 arc-90 21.25,17.88
  Top 0.2: 21.25,17.88 22.06,17.88 arc-90 22.5,17.4 22.5,15.9 arc90 22.6,15.7
  Top 0.254: 22.6,15.7 L4.1
N$16
  Top 0.406: IC1.5 13.2,23.24 R7.2
N$17
  Top 0.29: C12.2 46.75,14.36
  Top 0.406: 46.75,14.36 X1.P
N$18
  Top 0.254: R11.1 42.89,21.9 C9.2
  Top 0.29: 42.9,15.89 L2.2
  Top 0.305: C9.2 C8.2 L2.2
N$19
  Top 0.152: C15.1 arc-90 28.59,15.68
  Top 0.29: 28.59,15.68 IC6.6
N$20
  Top 0.254: R18.2 LED1.C@1
N$21
  Top 0.29: C11.1 35.37,15.67
  Top 0.406: 35.37,15.67 IC6.11
N$22
  Top 0.277: USB.D+ 5.55,13.55 4.75,13.55 4.6,13.4 4.6,12 4.6,6.5 5.01,6.09 IC2.1
N$23  (via drill 0.3)
  Top 0.254: IC1.4 11.78,22.3 10.7,22.3 10.5,22.5 v10.5,22.7
  Top 0.406: R9.2 v9.4,25.6 R10.1
  Bottom 0.254: v10.5,22.7 9.4,23.7 v9.4,25.6
N$24
  Top 0.29: C14.1 arc90 29.2,16.31 IC6.5
N$25
  Top 0.254: 26.1,15.7 C13.1
  Top 0.29: L4.2 26.1,15.7 C15.2
  Top 0.406: 26.1,15.7 C13.1 26.1,15.8
N$26
  Top 0.254: 27.4,17.2 27.5,17.1 C14.2 | C13.2 26.1,17.2
  Top 0.29: L3.2 26.1,17.2 27.4,17.2
N$27
  Top 0.254: R27.2 C36.1 R22.1 25.6,24.5 L6.2
N$28
  Top 0.254: R29.2 26.91,22 C42.2 25.7,22 | L8.2 25.7,22 | 25.7,22 R35.2
N$29
  Bottom 0.254: L5.2 R25.1 C34.1 R26.2
N$30
  Bottom 0.254: R31.2 | R28.2 26.89,21.9 C40.2 R31.2 | L7.2 R31.2
N$31
  Top 0.152: IC3.25 13.23,15.08 11.98,15.08 11.2,14.3 11.1,14.3 10.9,14.3 | 10.9,14.3 11,14.3 10.9,14.3 | 10.9,14.3 R3.2
N$32
  Top 0.152: 13.26,15.5 IC3.24 11.68,15.48 11.4,15.2 R2.2
N$34  (via drill 0.3)
  Top 0.152: IC3.1 20.3,19.3 v20.9,19.3
  Bottom 0.254: v20.9,19.3 21,19.2 C10.2
N$35  (via drill 0.3)
  Top 0.29: X2.P 45.3,7.4 arc90 45.15,7.22 45.15,3.52 arc-90 44.8,3.2 v44.51,3.2
  Bottom 0.29: C58.2 v44.51,3.2 | v44.51,3.2 44.51,4 | 44.51,4 C56.2 L9.2 | v44.51,3.2 44.51,4
N$36
  Top 0.152: R14.1 20.2,20 19.82,19.62 IC3.2
N$37
  Top 0.254: L2.1 42.9,14.4
  Top 0.29: IC5.3 41.59,14.34 L2.1 | 42.9,14.4 42.94,14.36 C12.1
N$38
  Top 0.29: IC5.1 C11.2
  Top 0.406: C11.2
N$39
  Top 0.152: R39.1 33.9,3 34.8,3.9 34.8,8.5 35.05,8.75 IC7.39
N$40
  Top 0.152: R39.2 34.2,3.8 34.5,4.1 34.5,8.7 35.05,9.25 IC7.38
N$41
  Top 0.152: IC3.20 12.22,17.08 11.9,17.45 10.9,17.45 R5.1
N$42
  Top 0.152: R39.3 34,4.6 34.2,4.8 34.2,7.7 34.2,8.9 35.05,9.75 IC7.37
N$43
  Top 0.152: R39.4 33.6,5.4 33.9,5.7 33.9,8.9 33.9,9 35.34,10.44 IC7.36
N$44
  Top 0.152: R40.1 33.3,6.2 33.6,6.5 33.6,9.1 35.6,11.1 36.5,11.1 36.75,10.85 IC7.35
N$45
  Top 0.152: R40.2 33.1,7 33.3,7.2 33.3,9.3 35.4,11.4 36.8,11.4 37.25,10.95 IC7.34
N$46  (via drill 0.3)
  Top 0.152: R40.3 v32.14,7.8 | v37.73,9.7 37.75,9.75 IC7.33
  Route2 0.152: v32.14,7.8 32.7,8.4 33.5,8.4 37,8.4 37.8,9.1 37.8,9.5 37.8,9.6 v37.73,9.7
N$47  (via drill 0.3)
  Top 0.152: R40.4 v32.14,8.6 | v38.3,9.7 38.25,9.8 IC7.32
  Route2 0.152: v32.14,8.6 32.3,8.7 36.9,8.7 37.3,9.1 37.3,9.9 37.6,10.2 38,10.2 38.1,10.2 v38.3,9.7
N$48
  Top 0.152: R41.1 32.9,9.4 35.2,11.7 38,11.7 38.6,11.7 39.25,11.05 IC7.30
N$49
  Top 0.152: R41.2 33.2,10.2 35,12 38.8,12 40.1,12 40.75,11.35 IC7.27
N$50
  Top 0.152: R41.3 33.5,11 34.8,12.3 40.7,12.3 41.25,11.75 IC7.26
N$51
  Top 0.152: R41.4 33.9,11.8 34.7,12.6 41.2,12.6 41.75,12.05 IC7.25
N$52
  Top 0.152: IC7.17 43.15,6.25 R49.1
N$53  (via drill 0.3)
  Top 0.29: IC7.5 38.25,2.65 arc90 38.9,1.9 41,1.9 42.35,1.9 arc90 v42.9,2.51
  Bottom 0.29: v42.9,2.51 C56.1
N$54  (via drill 0.3)
  Top 0.2: IC7.6 38.75,3.25
  Top 0.29: 38.75,3.25 arc90 39.6,2.3 41,2.3 41.4,2.3 arc90 42.69,3.36 v42.79,3.76
  Bottom 0.29: v42.79,3.76 arc-90 43.02,3.91 C58.1
N$55  (via drill 0.3)
  Top 0.254: v39.94,4.3 39.75,4.15 IC7.8
  Bottom 0.254: R42.1 40.45,4.3 v39.94,4.3
N$56
  Top 0.254: R47.2 LED2.A@1
OTIN  (via drill 0.3)
  Top 0.254: v19.2,20.2 19.02,19.98 IC3.4
  Bottom 0.254: L7.1 C39.2 R30.2 19.4,22 19.3,21.9 19.3,20.4 v19.2,20.2
OTIP  (via drill 0.3)
  Top 0.254: v18.8,20.6 18.62,20.42 IC3.5
  Bottom 0.254: L5.1 C33.1 R24.1 19.9,24.5 19.3,24.5 18.8,24 v18.8,20.6
OTQN
  Top 0.254: L6.1 C35.1 R21.1 18.7,24.5 17.82,23.62 IC3.7
OTQP
  Top 0.254: L8.1 C41.2 R34.2 19,22 18.22,21.22 IC3.6
PD_SL  (via drill 0.3)
  Top 0.152: 13.26,15.9 IC3.23 13.26,15.9 | 13.26,15.9 12.24,15.9 | 12.24,15.9 11.6,15.9 11.4,16.1 R1.2 | 13.26,15.9 12.24,15.9 | 12.24,15.9 12.24,16.1 v12.24,16.27 | 35.62,8.3 IC7.40 35.95,8.25 36.8,9.1 v38.3,9.1
  Route2 0.152: v12.24,16.27 11.5,15.6 11.5,13.2 11.5,13.1 11.5,10.8 11.5,10.1 11.5,7.2 11.5,5.9 12.1,5.2 12.1,3.2 12.1,2.6 12.4,2.3 19.7,2.3 29.2,2.3 30,2.3 30.1,2.2 30.3,2 31.1,2 31.5,2.6 31.5,5.1 32.1,5.7 34.2,5.7 34.4,5.9 34.4,7.2 35.5,8.1 37.1,8.1 38.2,9.1 v38.3,9.1
Q1
  Top 0.254: Q1.B 33.2,22.73 R23.2
QN
  Top 0.254: R27.1 R19.2 30.9,24.6 31.5,24 31.5,21.5 31.5,19.3 31.7,19.1 34,19.1 34.2,19.3 36,19.3 36.3,19 36.3,18.5 36.02,18.22 IC6.15
QP
  Top 0.254: R29.1 R20.2 30.9,22 31.1,21.8 31.1,19.7 31.1,19 31.5,18.7 32.5,18.7 33.9,18.7 34.4,18.7 34.55,18.85 IC6.16
REG1  (via drill 0.3)
  Top 0.254: IC3.60 21.5,16.68 v22,16.68
  Route15 0.406: v22,16.68 21.1,15.7 21.1,13.3 20.3,12.5 v15.7,12.5
  Bottom 0.254: v15.7,12.5 14.59,12.49 C16.+
  Bottom 0.406: FB6.2 FB10.2 FB7.2 14.44,13.8 14.5,13.5 14.5,12.1 C16.+
REG_OUT2  (via drill 0.3)
  Top 0.2: IC7.14 42.48,4.74 v43.3,4.74 | IC7.46 35.74,5.25 36.03,5.25 v36.2,5.1
  Route2 0.406: v36.2,5.1 36,5.3 32.3,5.3 31.9,4.9 v31.9,2.43
  Route15 0.406: v43.3,4.74 43.5,4.6 43.5,2.4 43.1,1.9 40.8,1.9 38,1.9 32.7,1.9 32.4,1.9 v31.9,2.43
  Bottom 0.2: C54.1 v43.3,4.74
  Bottom 0.406: FB13.2 31.6,10.3 31.6,7.4 31.6,6.8 FB14.2 31.8,5.3 FB12.2 31.9,3.72 v31.9,2.43
RF_EN  (via drill 0.3)
  Top 0.152: IC3.18 13.26,17.88 12,17.88 v11.6,18.3 R6.1
  Top 0.254: C30.1 36.4,21.69 36.4,21.2 36.3,21.1 v35.7,21.1 R23.1
  Route2 0.152: v11.6,18.3 11.6,19.9 12.8,21.1 13.9,21.1 21.6,21.1 30.7,21.1 v35.7,21.1
  Route2 0.254: v35.7,21.1 35.5,21.1
RST_SL  (via drill 0.3)
  Top 0.152: 13.26,18.3 IC3.17 13.26,18.27 13.22,18.3 12.4,18.3 v12.2,18.5 12.2,18.9 11.9,19.2 R8.1
  Top 0.2: v41.7,5.2 41.75,5.25 IC7.15
  Route2 0.152: v12.2,18.5 12.2,17.7 11.9,17.4 11.5,17.4 11.2,17.1 11.2,5.7 11.8,5 11.8,2.4 12.2,2 29.9,2 30.2,1.7 34.5,1.7 41.3,1.8
  Route2 0.2: 41.3,1.8 41.7,2.2 v41.7,5.2
SCL_M  (via drill 0.3)
  Top 0.152: v41,9.1 41.15,9.25 IC7.23 43.45,9.25 43.7,9.5 R46.2
  Top 0.2: IC3.48 20.22,11.4 20.21,11.6 20.48,11.6 v20.6,11.6
  Route2 0.152: v20.6,11.6 20.6,11.3 20.6,8.2 20.6,7.5 20.6,7.1 20.7,7 22.2,7 23.1,6.2 24.9,6.2 27,6.2 27.4,6.2 28,6.8 28,7.7 28.9,8.6 28.9,9.3 28.9,9.8 30,10.9 30,12 30.3,12.3 32.5,12.3 35.2,12.3 36.4,11.1 40.8,11.1 41.2,10.7 41.2,10.4 41.2,9.3 v41,9.1
SDA_M  (via drill 0.3)
  Top 0.152: IC3.49 21.2,12.24 v21.2,11.6 | IC7.22 43.15,8.75 v43.2,8.8 44.35,8.8 44.6,9.05 44.6,10 R44.2
  Route2 0.152: v21.2,11.6 20.9,11.2 20.9,10.7 20.9,7.6 20.9,7.4 21,7.3 22.3,7.3 23.2,6.5 24.8,6.5 27,6.5 27.3,6.5 27.7,6.9 27.7,7.8 28.6,8.7 28.6,9.3 28.6,9.9 29.7,11 29.7,11.9 29.7,12.3 30,12.6 32.5,12.6 35.3,12.6 36.5,11.4 40.9,11.4 41.5,10.8 41.5,9.3 42,8.8 v43.2,8.8
USB_M
  Top 0.277: IC2.4 17.6,4.2 17.92,4.62 17.9,8.4 17.9,9.6 18.22,9.91 IC3.43
USB_P
  Top 0.277: IC2.6 10.14,6.09 11.1,6.09 11.3,5.8 11.3,4.8 11.5,4.6 17.4,4.6 17.52,4.82 17.5,7 17.5,9.8 17.82,10.1 17.82,11.31 IC3.42
V
  Top 0.406: C38.2 36.33,24.2 | 34.08,24.72 Q1.C
  pour Top (no thermals): 38.8,20.7 38.8,21.8 38.6,22 38.6,24 38,24.5 35.1,24.5 34.8,24.8 34.8,25.9 34.7,26 33.5,26 33.3,25.8 33.3,24.5 33.8,23.9 37,23.9 37.4,23.5 37.4,21 37.7,20.7
VBUS  (via drill 0.3, 0.4)
  Top 0.406: R7.1 13.31,22.29 | IC1.3 | USB.VBUS v7.9,16 | v7.8,20.1 C2.2 | Q2.2 40,23.06
  Top 0.61: IC2.5 10.01,5.13 9.31,5.14 8.8,5.6 v8.8,7.1
  Route15 0.406: v7.9,16 8,16.1 | 8.8,20.1 v7.8,20.1
  Route15 0.61: v40,24.2 33.9,24.2 31.1,21.4 28.9,21.4 19.7,21.4 17.2,21.4 16.7,21.4 14.1,21.4 | v8.8,7.1 8.8,16.1 | 8.8,16.1 8.8,20.1 8.8,20.9 9.3,21.4 14.1,21.4 | v14.1,22.29 14.09,21.9 14.1,21.4 | 8,16.1 8.8,16.1
  Bottom 0.61: IC8.3 23.6,3.74 C59.1 22.26,3.7 21.36,3.7 21.06,3.4 20.6,3.4 19,3.4 11.8,3.4 11.4,3.7 8.8,6.3 v8.8,7.1
  pour Top (no thermals): 8.9,22.7 8.9,21.8 9.3,21.4 16.3,21.4 16.6,21.8 16.6,22.8 16.4,23 14.7,23 14.4,22.7 13,22.7 12.8,22.5 12.8,21.9 12.7,21.8 10.3,21.8 10.2,21.9 10.2,22.7
  pour Top (no thermals): 40.5,24.2 40.5,20.9 40.3,20.7 39.6,20.7 39.4,20.9 39.4,24.1 39.7,24.5 40.3,24.5
VCC  (via drill 0.3)
  Top 0.152: IC3.44 18.62,9.92 18.62,9.61 v18.43,9.41 | v22.05,13 21.92,13.08 IC3.51
  Top 0.2: IC3.44 18.62,11.36 18.62,12 | 21.14,13.08 IC3.51 21.14,13.08 | 18.62,12 18.2,12 14.7,12 14.1,12.6 14.1,14 14.1,16.08 v13.93,16.27 13.86,16.28 13.74,16.28 13.32,16.28 IC3.22 | 18.62,12 19.6,12 20.68,13.08 21.14,13.08
  Bottom 0.2: v13.93,16.27 13.87,16.28 | 12.98,17.32 FB1.1 | C26.2 12.97,15.58
  Bottom 0.254: v18.43,9.41 18.53,9.33 C27.2 | C28.2 v22.05,13 | 13.87,16.28 12.97,16.28 | 12.97,16.28 12.98,17.32 | 12.97,15.58 12.97,16.28
  Bottom 0.406: C26.2 13.03,15.31
VCC3V  (via drill 0.3)
  Top 0.152: 13.26,16.7 IC3.21 13.26,16.7 | IC3.27 13.29,14.3 | IC3.34 14.61,11.31 v14.61,10.1 | IC3.47 19.82,11.52 19.82,10.3 v19.9,10.1 | 13.26,16.7 12.7,16.7 11.8,16.7 v11.69,16.75 | IC3.27 13.23,14.28 13.08,14.28 | v12.1,14.1 12.28,14.28 IC3.27
  Top 0.2: 21.09,12.68 IC3.50 21.7,12.68 21.9,12.48 21.9,12.3 v21.9,10.5
  Top 0.254: R4.1 R3.1 R2.1 R1.1 9.8,16.4 10.19,16.75 v11.69,16.75
  Bottom 0.254: v14.61,10.1 C47.2 | 11.67,13.67 C45.2 | C44.2 v19.9,10.1
  Bottom 0.305: v12.1,14.1 12,14.2 11.6,14.2 11.49,14.2
  Bottom 0.406: v11.69,16.75 11.55,16.55 FB4.1 11.49,15.51 11.49,14.2 C45.2 11.51,13.67 C43.2 11.5,10.7 12,10.1 v14.61,10.1 v19.9,10.1 21.5,10.1 v21.9,10.5 22.59,10.5 C46.2
VDD3V3  (via drill 0.3)
  Top 0.254: v20.8,4.3 20.8,4.31
  Top 0.406: IC4.8 20.8,4.31 20.11,4.31 C6.1 19.8,7 R12.1 R13.1 | R15.2 v23.8,12.1
  Route15 0.406: v23.8,12.1 24.6,11.2 24.6,8.8 24.6,4.7 24.2,4.3 v20.8,4.3
  Bottom 0.406: FB3.1 v20.8,4.3
VDD33_LO_2  (via drill 0.3)
  Top 0.2: IC7.11 arc45 41.25,3.69 v41.25,4.3
  Bottom 0.254: v41.25,4.3 41.21,4.3 C63.1
  Bottom 0.305: R43.2 41.6,4.1 41.4,4.3 v41.25,4.3
VDD_DAC  (via drill 0.3)
  Top 0.2: v14.8,18.5 15.02,18.68 IC3.14
  Bottom 0.254: FB10.1 15.5,15.5 15.4,15.7 15.4,16.5 15.4,17.5 15.4,17.8 15.4,18.3 15.4,18.5 | 15.4,18.5 15.4,19 15.59,19.29 C48.1 15.99,19.4 | v14.8,18.5 15.4,18.5
VDD_EN_PWR  (via drill 0.3)
  Top 0.254: R18.1 v44.8,25.3
  Top 0.61: C38.1 | Q2.3 39.09,25.3 | FB9.2 41.32,25.28
  Bottom 0.254: v44.8,25.3 43,25.3 42.5,25.3 v40,25.3
  Bottom 0.61: v35.4,25.2 32.2,25.2 FB8.2
  pour Top (no thermals): 35.3,24.9 40.7,24.9 40.9,24.7 40.9,23.2 41.8,23.2 41.8,25.8 39.9,25.8 39.5,26.1 35.4,26.1 35.1,25.8 35.1,25.1
VDD_LO  (via drill 0.3)
  Top 0.2: v20.2,17 20.33,17.08 IC3.61
  Bottom 0.406: v20.2,17 20.2,17.2 19.9,17.5 19.21,17.5 C31.2 C32.2 16.01,17.49 FB6.1
VDDIO2_S  (via drill 0.3)
  Top 0.2: IC7.28 40.25,10.43 v40.25,9.69 | IC7.21 42.41,8.25 v41.63,8.25
  Top 0.254: v36.4,7.6 36.15,7.75 IC7.41
  Top 0.406: R44.1 R46.1 v43,11.1
  Route15 0.406: v43,11.1 42,11.1 41.63,10.73 v41.63,8.25 40.55,8.25 40.3,8.5 40.3,9.64 v40.25,9.69
  Bottom 0.254: R38.2
  Bottom 0.305: R38.2 38.59,1.92 38.73,1.78 40.14,1.78 40.3,1.94 R43.1
  Bottom 0.406: R38.2 38.6,3.4 38.6,3.7 38.59,4.7 38.59,4.71 FB11.2 38.6,5.1 38.6,5.7 37.8,5.7 36.2,5.7 35.7,5.7 35.7,6.6 35.7,7.4 35.7,7.6 | 35.7,7.6 35.7,9.9 35.7,10.6 38.6,10.6 39.5,10.6 39.7,10.6 40.25,10.6 v40.25,9.69 40.25,8.86 C52.1 | 35.7,7.6 v36.4,7.6

## Text on the board
tNames: PWR | 2023-04-06